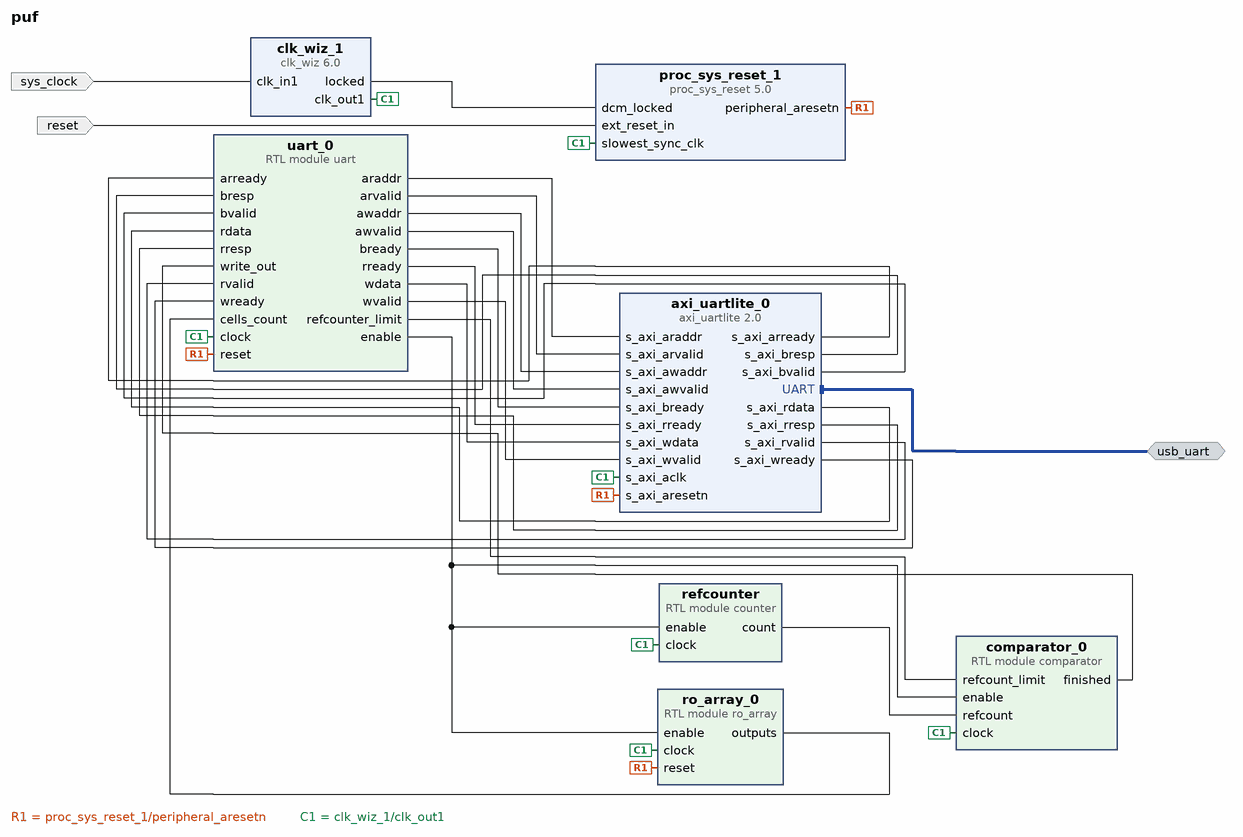
[diagram p0: block diagram of the top level]
# Vivado block design puf, xc7a100tcsg324-1, Vivado 2022.2
create_bd_design puf

create_bd_intf_port -mode Master -vlnv xilinx.com:interface:uart_rtl:1.0 usb_uart
create_bd_port -dir I -type clk sys_clock
set_property -dict {CONFIG.ASSOCIATED_RESET reset CONFIG.FREQ_HZ 100000000 CONFIG.PHASE 0.000} [get_bd_ports sys_clock]
create_bd_port -dir I -type rst reset
set_property -dict {CONFIG.POLARITY ACTIVE_LOW} [get_bd_ports reset]

create_bd_cell -type ip -vlnv xilinx.com:ip:clk_wiz:6.0 clk_wiz_1
set_property -dict [list \
  CONFIG.CLKOUT1_DRIVES BUFG \
  CONFIG.CLKOUT1_JITTER 137.681 \
  CONFIG.CLKOUT1_PHASE_ERROR 105.461 \
  CONFIG.CLKOUT2_DRIVES BUFG \
  CONFIG.CLKOUT3_DRIVES BUFG \
  CONFIG.CLKOUT4_DRIVES BUFG \
  CONFIG.CLKOUT5_DRIVES BUFG \
  CONFIG.CLKOUT6_DRIVES BUFG \
  CONFIG.CLKOUT7_DRIVES BUFG \
  CONFIG.MMCM_BANDWIDTH OPTIMIZED \
  CONFIG.MMCM_CLKFBOUT_MULT_F 9 \
  CONFIG.MMCM_CLKOUT0_DIVIDE_F 9 \
  CONFIG.MMCM_COMPENSATION ZHOLD \
  CONFIG.PRIMITIVE PLL \
] [get_bd_cells clk_wiz_1]
create_bd_cell -type ip -vlnv xilinx.com:ip:proc_sys_reset:5.0 proc_sys_reset_1
create_bd_cell -type ip -vlnv xilinx.com:ip:axi_uartlite:2.0 axi_uartlite_0
set_property -dict {CONFIG.C_BAUDRATE 230400} [get_bd_cells axi_uartlite_0]
create_bd_cell -type module -reference comparator comparator_0
create_bd_cell -type module -reference counter refcounter
set_property -dict {CONFIG.size 16} [get_bd_cells refcounter]
create_bd_cell -type module -reference uart uart_0
create_bd_cell -type module -reference ro_array ro_array_0

# ---- connections ----

connect_bd_intf_net -intf_net axi_uartlite_2_UART [get_bd_intf_ports usb_uart] [get_bd_intf_pins axi_uartlite_0/UART]
connect_bd_net -net axi_uartlite_2_s_axi_arready [get_bd_pins axi_uartlite_0/s_axi_arready] [get_bd_pins uart_0/arready]
connect_bd_net -net axi_uartlite_2_s_axi_bresp [get_bd_pins axi_uartlite_0/s_axi_bresp] [get_bd_pins uart_0/bresp]
connect_bd_net -net axi_uartlite_2_s_axi_bvalid [get_bd_pins axi_uartlite_0/s_axi_bvalid] [get_bd_pins uart_0/bvalid]
connect_bd_net -net axi_uartlite_2_s_axi_rdata [get_bd_pins axi_uartlite_0/s_axi_rdata] [get_bd_pins uart_0/rdata]
connect_bd_net -net axi_uartlite_2_s_axi_rresp [get_bd_pins axi_uartlite_0/s_axi_rresp] [get_bd_pins uart_0/rresp]
connect_bd_net -net axi_uartlite_2_s_axi_rvalid [get_bd_pins axi_uartlite_0/s_axi_rvalid] [get_bd_pins uart_0/rvalid]
connect_bd_net -net axi_uartlite_2_s_axi_wready [get_bd_pins axi_uartlite_0/s_axi_wready] [get_bd_pins uart_0/wready]
connect_bd_net [get_bd_pins clk_wiz_1/locked] [get_bd_pins proc_sys_reset_1/dcm_locked]
connect_bd_net [get_bd_pins comparator_0/finished] [get_bd_pins uart_0/write_out]
connect_bd_net -net control_0_enable_counting [get_bd_pins uart_0/enable] \
  [get_bd_pins comparator_0/enable] [get_bd_pins refcounter/enable] [get_bd_pins ro_array_0/enable]
connect_bd_net -net proc_sys_reset_0_peripheral_aresetn [get_bd_pins proc_sys_reset_1/peripheral_aresetn] \
  [get_bd_pins axi_uartlite_0/s_axi_aresetn] [get_bd_pins uart_0/reset] [get_bd_pins ro_array_0/reset]
connect_bd_net [get_bd_pins refcounter/count] [get_bd_pins comparator_0/refcount]
connect_bd_net [get_bd_ports reset] [get_bd_pins proc_sys_reset_1/ext_reset_in]
connect_bd_net [get_bd_pins ro_array_0/outputs] [get_bd_pins uart_0/cells_count]
connect_bd_net -net sys_clock_1 [get_bd_pins clk_wiz_1/clk_out1] \
  [get_bd_pins proc_sys_reset_1/slowest_sync_clk] [get_bd_pins axi_uartlite_0/s_axi_aclk] [get_bd_pins comparator_0/clock] \
  [get_bd_pins refcounter/clock] [get_bd_pins uart_0/clock] [get_bd_pins ro_array_0/clock]
connect_bd_net [get_bd_ports sys_clock] [get_bd_pins clk_wiz_1/clk_in1]
connect_bd_net [get_bd_pins uart_0/araddr] [get_bd_pins axi_uartlite_0/s_axi_araddr]
connect_bd_net [get_bd_pins uart_0/arvalid] [get_bd_pins axi_uartlite_0/s_axi_arvalid]
connect_bd_net [get_bd_pins uart_0/awaddr] [get_bd_pins axi_uartlite_0/s_axi_awaddr]
connect_bd_net [get_bd_pins uart_0/awvalid] [get_bd_pins axi_uartlite_0/s_axi_awvalid]
connect_bd_net [get_bd_pins uart_0/bready] [get_bd_pins axi_uartlite_0/s_axi_bready]
connect_bd_net [get_bd_pins uart_0/refcounter_limit] [get_bd_pins comparator_0/refcount_limit]
connect_bd_net [get_bd_pins uart_0/rready] [get_bd_pins axi_uartlite_0/s_axi_rready]
connect_bd_net [get_bd_pins uart_0/wdata] [get_bd_pins axi_uartlite_0/s_axi_wdata]
connect_bd_net [get_bd_pins uart_0/wvalid] [get_bd_pins axi_uartlite_0/s_axi_wvalid]

validate_bd_design
save_bd_design
